# EAGLE design base (EAGLE 7.7.0)
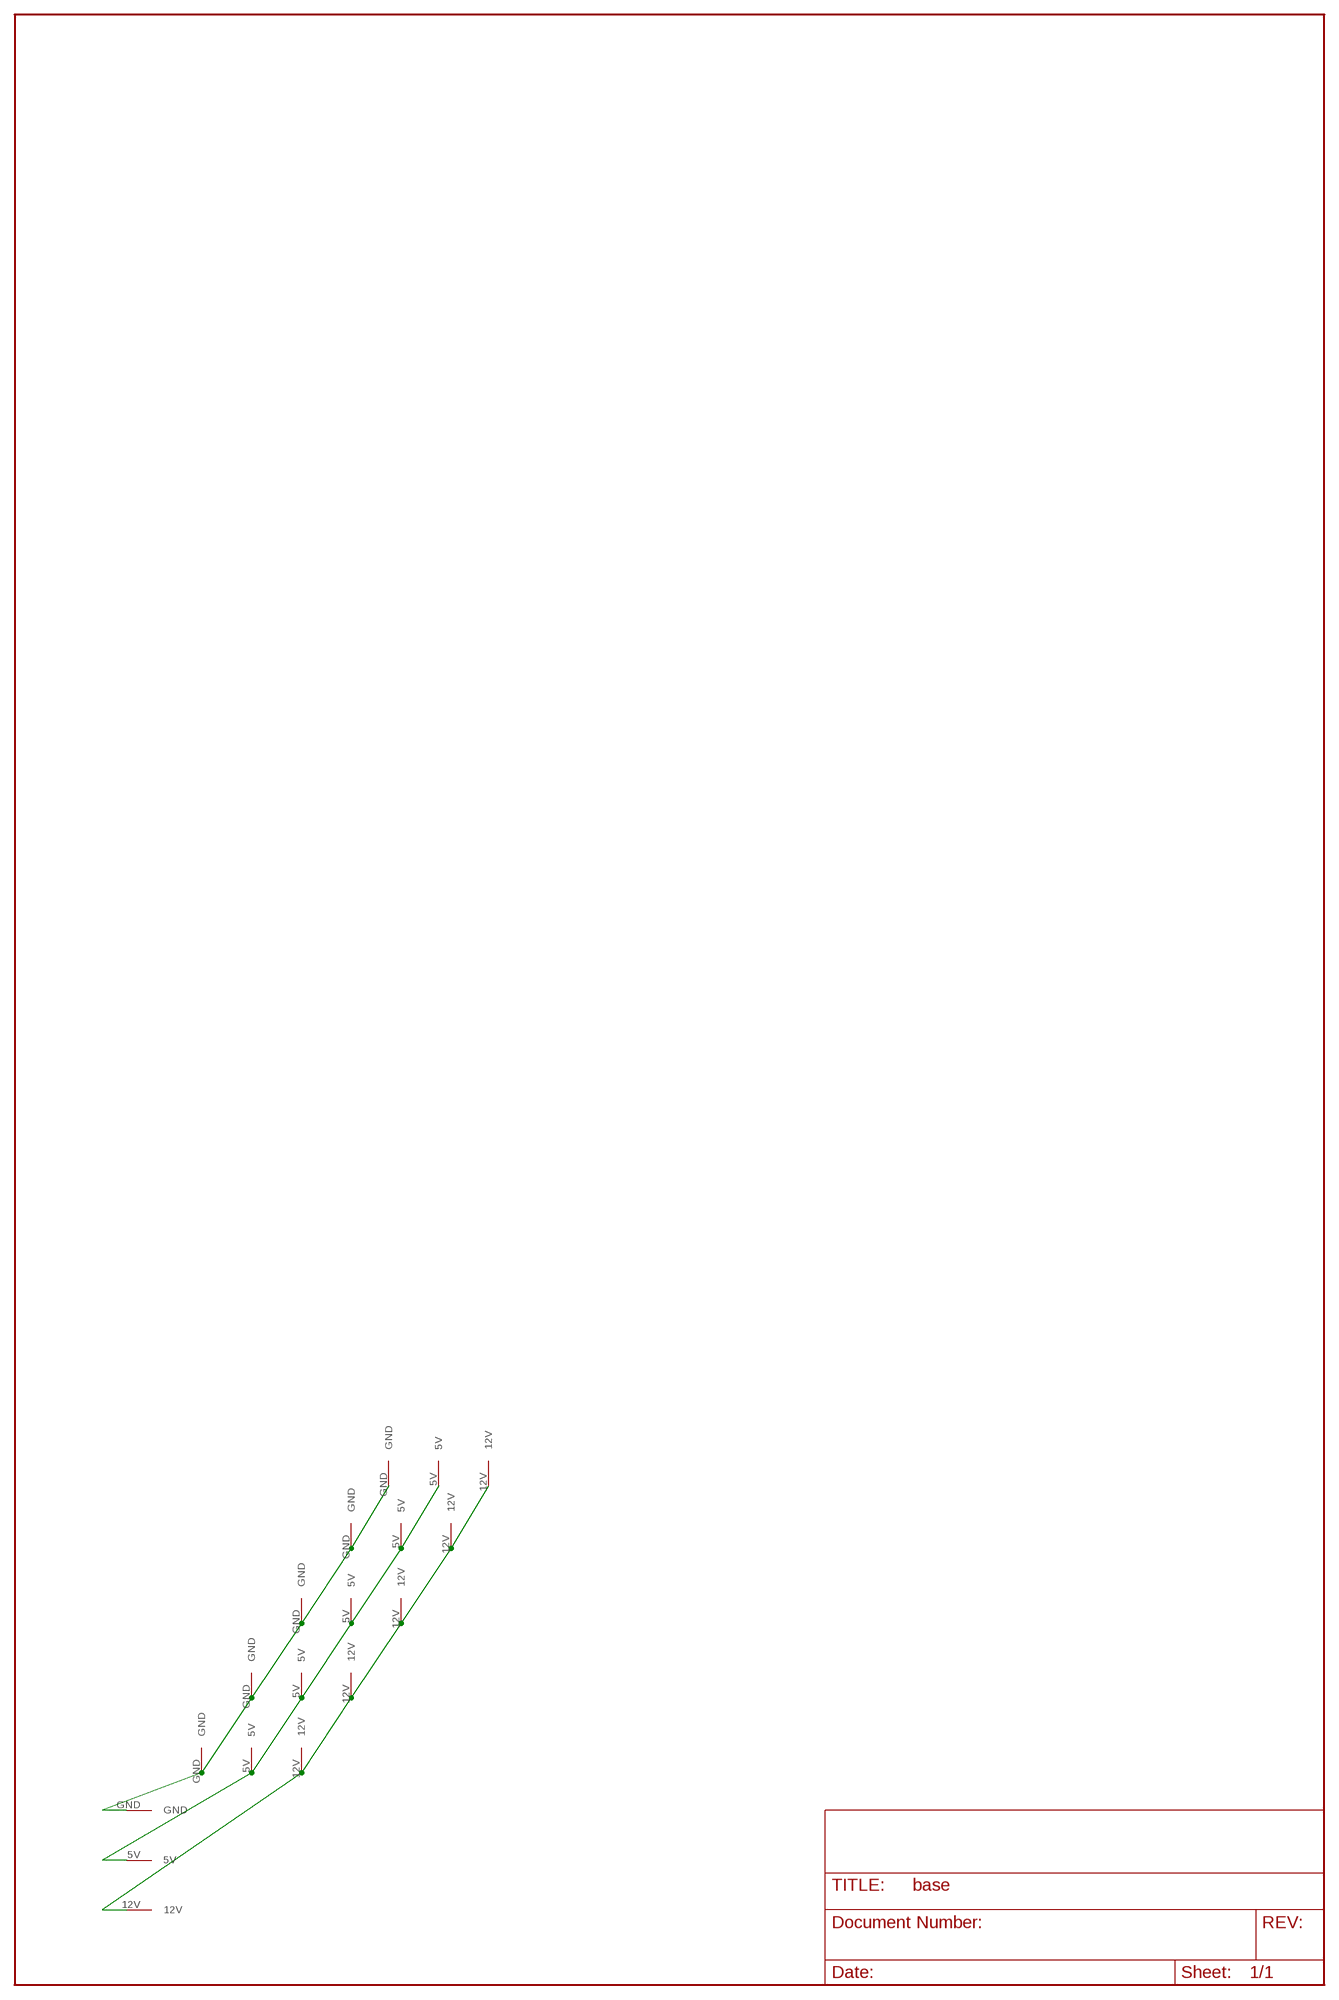
[diagram p0: schematic, sheet 1]

## Parts
U$1  3POLE  [ARC2]
U$2  3POLE  [ARC2]
U$3  3POLE  [ARC2]
U$4  3POLE  [ARC2]
U$5  3POLE  [ARC2]
U$6  3POLE  [ARC2]

## Nets
5V: U$1.5V U$2.5V U$3.5V U$4.5V U$5.5V U$6.5V
12V: U$1.12V U$2.12V U$3.12V U$4.12V U$5.12V U$6.12V
GND: U$1.GND U$2.GND U$3.GND U$4.GND U$5.GND U$6.GND

## Library data of the parts
U$1-U$6 = jack:3POLE

## Net classes
1 Vcc: width 3.607 mm, drill 0.381 mm, clearance 0.254 mm

## Board
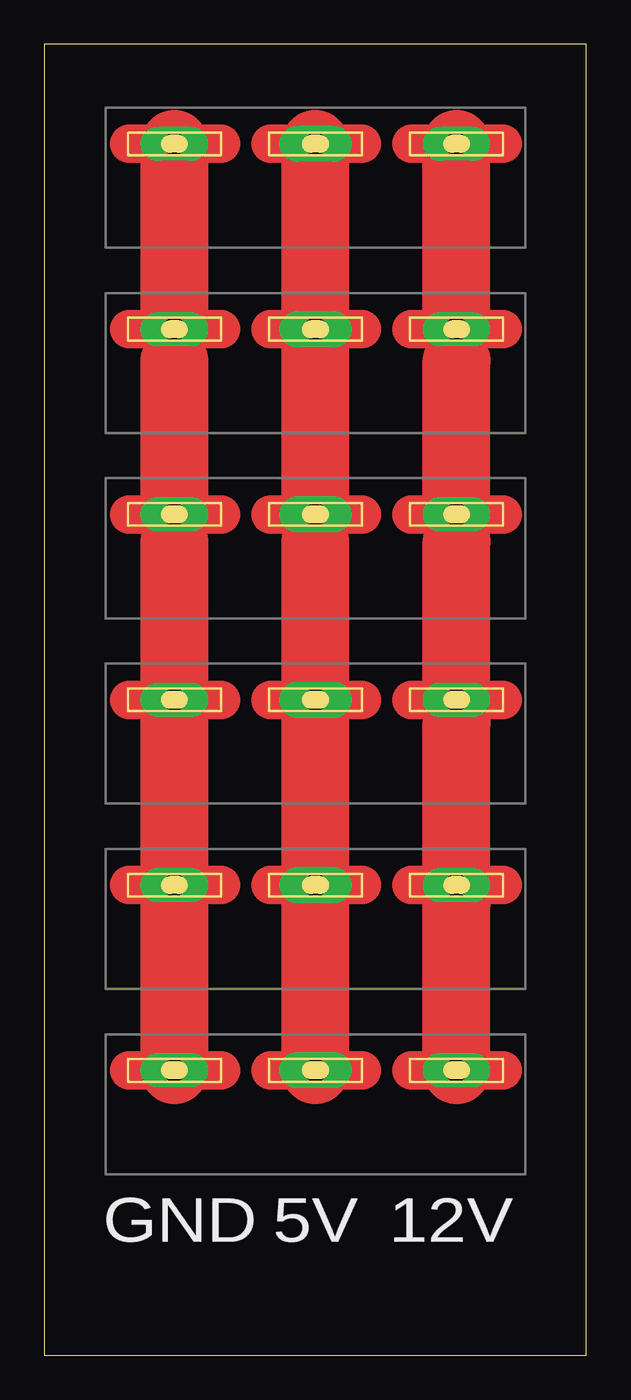
[diagram p1: board, top side]
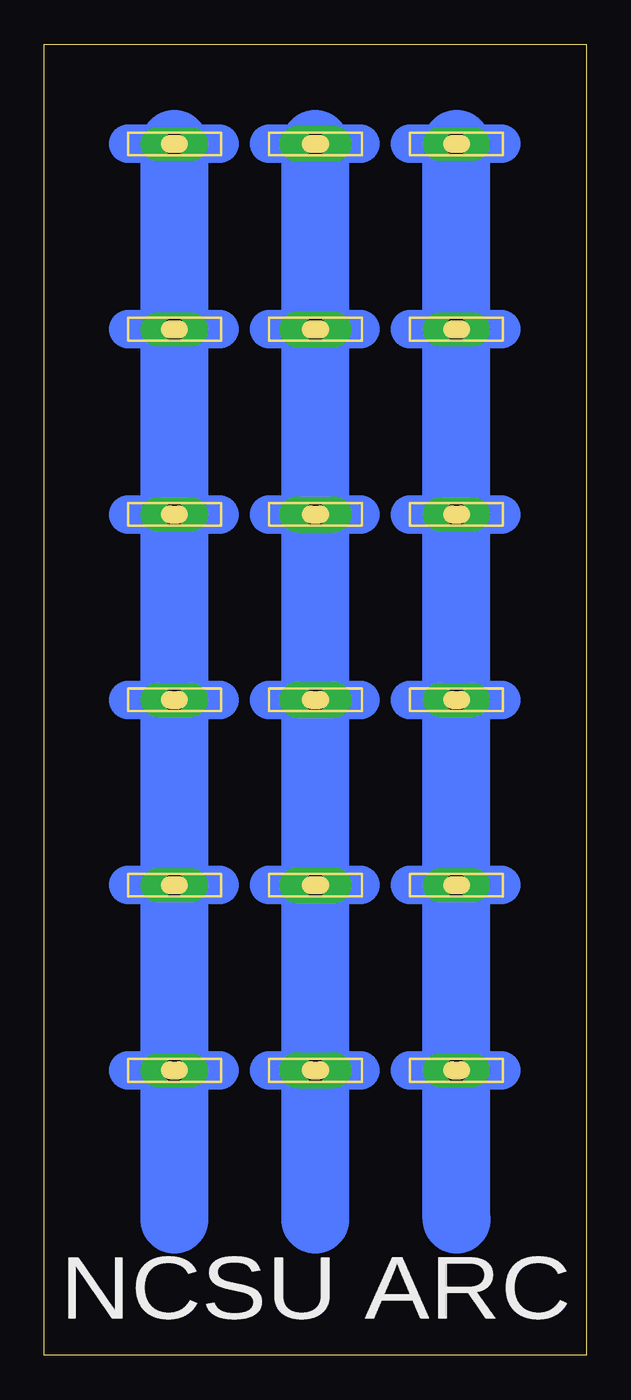
[diagram p2: board, bottom side, seen from below]

Size 30.48 x 73.66 mm. Coordinates in mm from the lower left corner, seen from the top.
Outline: 0,0 30.48,0 30.48,73.66 0,73.66 0,0
Copper layers (1*16): Top 0.035mm / dielectric 1.5mm / Bottom 0.035mm
Design rules "default": minimum track width 10mil, minimum drill 24mil, track to track 8mil, track to pad 8mil, pad to pad 8mil, via to via 8mil, smd to smd 8mil, copper to edge 40mil, drill to drill 8mil, minimum pad ring 10mil, minimum via ring 8mil, stop-mask expansion 4mil, vias tented up to drill 0mil, thermal gap 10mil

### Footprints (pad centres in the part's own frame; a part is rotated, then mirrored left to right if it is on the bottom)
ARC2 = drill 1.27 pad 2.032 long: 5V 0,0 | drill 1.27 long: 12V 7.925,0; GND -7.925,0

### Placement (x,y rotation side)
U$1  15.24,16 0 top
U$2  15.24,26.42 0 top
U$3  15.24,36.83 0 top
U$4  15.24,47.24 0 top
U$5  15.24,57.66 0 top
U$6  15.24,68.07 0 top

### Tracks (layer width: path | path; a pad name or v marks a point on that pad's centre or on a via)
5V
  Top 3.81: U$1.5V 15.24,25.4 | U$2.5V 15.24,45.72 | U$4.5V U$6.5V
  Bottom 3.81: U$6.5V U$5.5V U$4.5V U$3.5V U$2.5V U$1.5V 15.24,7.62
12V
  Top 3.81: U$1.12V 23.16,25.4 | U$2.12V 23.16,35.56 | U$3.12V 23.16,45.72 | U$4.12V 23.16,55.88 | U$5.12V U$6.12V
  Bottom 3.81: U$6.12V U$5.12V U$4.12V U$3.12V U$2.12V U$1.12V 23.16,7.62
GND
  Top 3.81: U$1.GND 7.32,25.4 | U$2.GND 7.32,35.56 | U$3.GND 7.32,45.72 | U$4.GND 7.32,55.88 | U$5.GND U$6.GND
  Bottom 3.81: U$6.GND U$4.GND U$3.GND U$2.GND U$1.GND 7.32,7.62

### Text on the board
tNames: GND | 5V | 12V
bNames: NCSU ARC